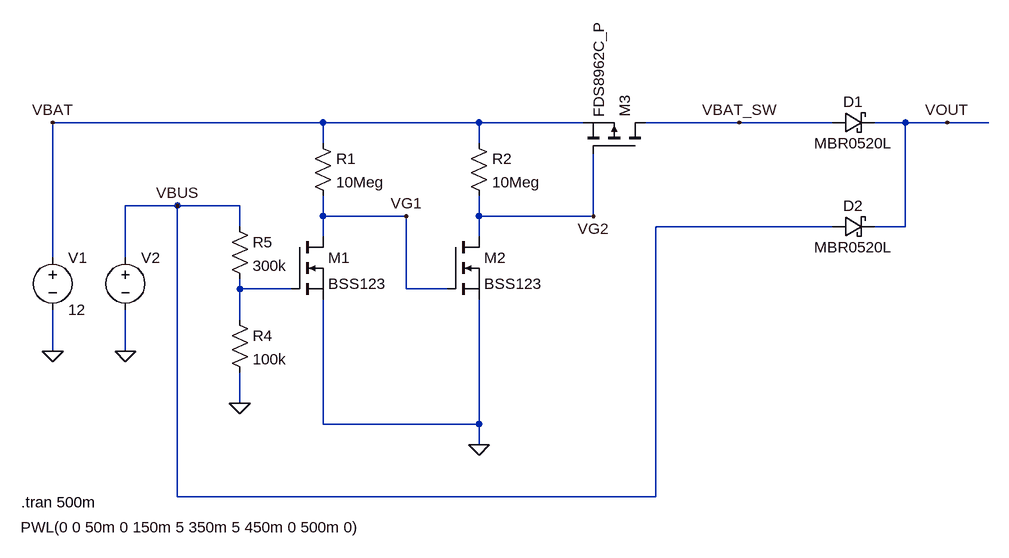
[diagram p0: schematic V_BAT switch_div.asc]
V_BAT switch_div.asc, the LTspice schematic file:
Version 4
SHEET 1 1872 680
WIRE 176 -48 -240 -48
WIRE 416 -48 176 -48
WIRE 576 -48 416 -48
WIRE 816 -48 672 -48
WIRE 960 -48 816 -48
WIRE 1072 -48 1024 -48
WIRE 1136 -48 1072 -48
WIRE 1200 -48 1136 -48
WIRE 176 -16 176 -48
WIRE 416 -16 416 -48
WIRE -48 80 -128 80
WIRE 48 80 -48 80
WIRE 176 96 176 64
WIRE 304 96 176 96
WIRE 416 96 416 64
WIRE 592 96 592 0
WIRE 592 96 416 96
WIRE 48 112 48 80
WIRE 960 112 688 112
WIRE 1072 112 1072 -48
WIRE 1072 112 1024 112
WIRE 176 128 176 96
WIRE 416 128 416 96
WIRE -240 160 -240 -48
WIRE -128 160 -128 80
WIRE 48 208 48 192
WIRE 128 208 48 208
WIRE 304 208 304 96
WIRE 368 208 304 208
WIRE 48 256 48 208
WIRE -240 304 -240 240
WIRE -128 304 -128 240
WIRE 48 384 48 336
WIRE 176 416 176 224
WIRE 416 416 416 224
WIRE 416 416 176 416
WIRE 416 448 416 416
WIRE -48 528 -48 80
WIRE 688 528 688 112
WIRE 688 528 -48 528
FLAG -240 304 0
FLAG -128 304 0
FLAG -240 -48 VBAT
FLAG -48 80 VBUS
FLAG 816 -48 VBAT_SW
FLAG 1136 -48 VOUT
FLAG 304 96 VG1
FLAG 592 96 VG2
FLAG 416 448 0
FLAG 48 384 0
SYMBOL nmos 128 128 R0
SYMATTR InstName M1
SYMATTR Value BSS123
SYMBOL pmos 672 0 M270
SYMATTR InstName M3
SYMATTR Value FDS8962C_P
SYMBOL voltage -240 144 R0
WINDOW 123 0 0 Left 0
WINDOW 39 0 0 Left 0
SYMATTR InstName V1
SYMATTR Value 12
SYMBOL voltage -128 144 R0
WINDOW 123 0 0 Left 0
WINDOW 39 0 0 Left 0
WINDOW 3 -161 431 Left 2
SYMATTR Value PWL(0 0 50m 0 150m 5 350m 5 450m 0 500m 0)
SYMATTR InstName V2
SYMBOL res 160 -32 R0
SYMATTR InstName R1
SYMATTR Value 10Meg
SYMBOL res 400 -32 R0
SYMATTR InstName R2
SYMATTR Value 10Meg
SYMBOL schottky 960 -32 R270
WINDOW 0 32 32 VTop 2
WINDOW 3 0 32 VBottom 2
SYMATTR InstName D1
SYMATTR Value MBR0520L
SYMATTR Description Diode
SYMATTR Type diode
SYMBOL nmos 368 128 R0
SYMATTR InstName M2
SYMATTR Value BSS123
SYMBOL schottky 960 128 R270
WINDOW 0 32 32 VTop 2
WINDOW 3 0 32 VBottom 2
SYMATTR InstName D2
SYMATTR Value MBR0520L
SYMATTR Description Diode
SYMATTR Type diode
SYMBOL res 32 240 R0
SYMATTR InstName R4
SYMATTR Value 100k
SYMBOL res 32 96 R0
SYMATTR InstName R5
SYMATTR Value 300k
TEXT -288 536 Left 2 !.tran 500m

The netlist it stands for:
* V_BAT switch_div.asc
M1 VG1 N001 0 0 BSS123
M3 VBAT_SW VG2 VBAT VBAT FDS8962C_P
V1 VBAT 0 12
V2 VBUS 0 PWL(0 0 50m 0 150m 5 350m 5 450m 0 500m 0)
R1 VBAT VG1 10Meg
R2 VBAT VG2 10Meg
D1 VBAT_SW VOUT MBR0520L
M2 VG2 VG1 0 0 BSS123
D2 VBUS VOUT MBR0520L
R4 N001 0 100k
R5 VBUS N001 300k
.model D D
.lib standard.dio
.model NMOS NMOS
.model PMOS PMOS
.lib standard.mos
.tran 500m
.backanno
.end